# EAGLE schematic ir (EAGLE 9.4.2)
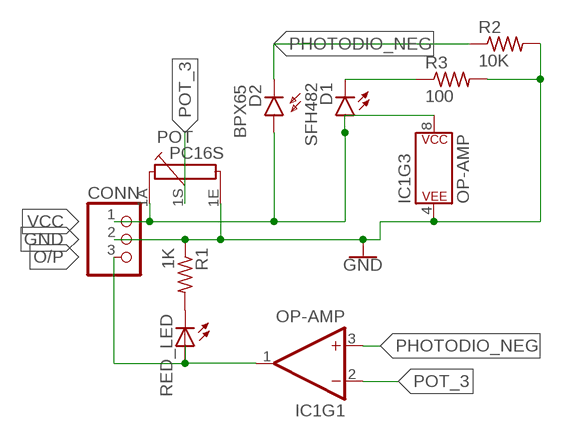
[diagram p0: schematic, sheet 1]

## Parts
CONN  PINHD-1X3  [1X03]
D1  SFH482  [SFH482]
D2  BPX65  [BPX65]
IC1  OP-AMP  OPAMP-DUALDIP  [DIP08]
POT  PC16S  [PC16S]
R1  1K  FLIPFLOP-RES  [0805-THM]
R2  10K  FLIPFLOP-RES  [0805-THM]
R3  100  FLIPFLOP-RES  [0805-THM]
RED_LED  LED3MM  [LED3MM]

## Nets
GND: CONN.2 IC1.4(P$V-) POT.1E R1.1 R2.2 R3.2
N$1: R1.2 RED_LED.K(C)
N$3: D1.K(C) R3.1
O/P: CONN.3 IC1.1(OUT) RED_LED.A
PHOTODIO_NEG: D2.K(C) IC1.3(+IN) R2.1
POT_3: IC1.2(-IN) POT.1S
VCC: CONN.1 D1.A D2.A IC1.8(P$V+) POT.1A
Unconnected: IC1.5(+IN) IC1.6(-IN) IC1.7(OUT)

## Library data of the parts
CONN = pinhead:PINHD-1X3: PIN HEADER
D1 = led:SFH482: IR LED infrared emitting diode, Infineon
D2 = opto-trans-siemens:BPX65: PHOTO DIODE; MPN: BPX65.; OC_FARNELL: 327451; OC_NEWARK: 06WX2764
IC1 = SparkFun-IC-Amplifiers:OPAMP-DUAL: Generic op-amp footprint This component is for the standard 358 pinning of a dual op-amp From the LM358 datasheet: Pin 1: Output A Pin 2: Inverting Input A Pin 3: Non-Inverting Input A Pin 4: Gnd Pin 5: Non-Inverting Input B Pin 6: Inverting Input B Pin 7: Output B Pin 8: V+; PROD_ID: NA-XXXXX
POT = piher:PC16S: POTENTIOMETER single carbon potentiometer, 16 mm, S3ROH; OC_FARNELL: 4452940; OC_NEWARK: unknown
R1-R3 = adafruit:FLIPFLOP-RES: Flip Flop resistor An 0805 resistor inside a standard 1/4W 5% resistor. Makes for easy mods
RED_LED = adafruit:LED: LED OSRAM: - CHIPLED LG R971, LG N971, LY N971, LG Q971, LY Q971, LO R971, LY R971 LH N974, LH R974 LS Q976, LO Q976, LY Q976 LO Q996 - Hyper CHIPLED LW Q18S LB Q993, LB Q99A, LB R99A - SideLED LS A670, LO A670, LY A670, LG A670, LP A670 LB A673, LV A673, LT A673, LW A673 LH A674 LY A675 LS A676, LA A676, LO A676, LY A676, LW A676 LS A679, LY A679, LG A679 - Hyper Micro SIDELED® LS Y876, LA Y876, LO Y876, LY Y876 LT Y87S - SmartLED LW L88C, LW L88S LB L89C, LB L89S, LG L890 LS L89K, LO L89K, LY L89K LS L896, LA L896, LO L896, LY L896 - TOPLED LS T670, LO T670, LY T670, LG T670, LP T670 LSG T670, LSP T670, LSY T670, LOP T670, LYG T670 LG T671, LOG T671, LSG T671 LB T673, LV T673, LT T673, LW T673 LH T674 LS T676, LA T676, LO T676, LY T676, LB T676, LH T676, LSB T676, LW T676 LB T67C, LV T67C, LT T67C, LS T67K, LO T67K, LY T67K, LW E67C LS E67B, LA E67B, LO E67B, LY E67B, LB E67C, LV E67C, LT E67C LW T67C LS T679, LY T679, LG T679 LS T770, LO T770, LY T770, LG T770, LP T770 LB T773, LV T773, LT T773, LW T773 LH T774 LS E675, LA E675, LY E675, LS T675 LS T776, LA T776, LO T776, LY T776, LB T776 LHGB T686 LT T68C, LB T68C - Hyper Mini TOPLED® LB M676 - Mini TOPLED Santana® LG M470 LS M47K, LO M47K, LY M47K Source: http://www.osram.convergy.de/